# Altium schematic sheet ECE_1895_Pjt2_Sch_10_21_24.SchDoc
size A; SheetNumber: 1; SheetTotal: 3
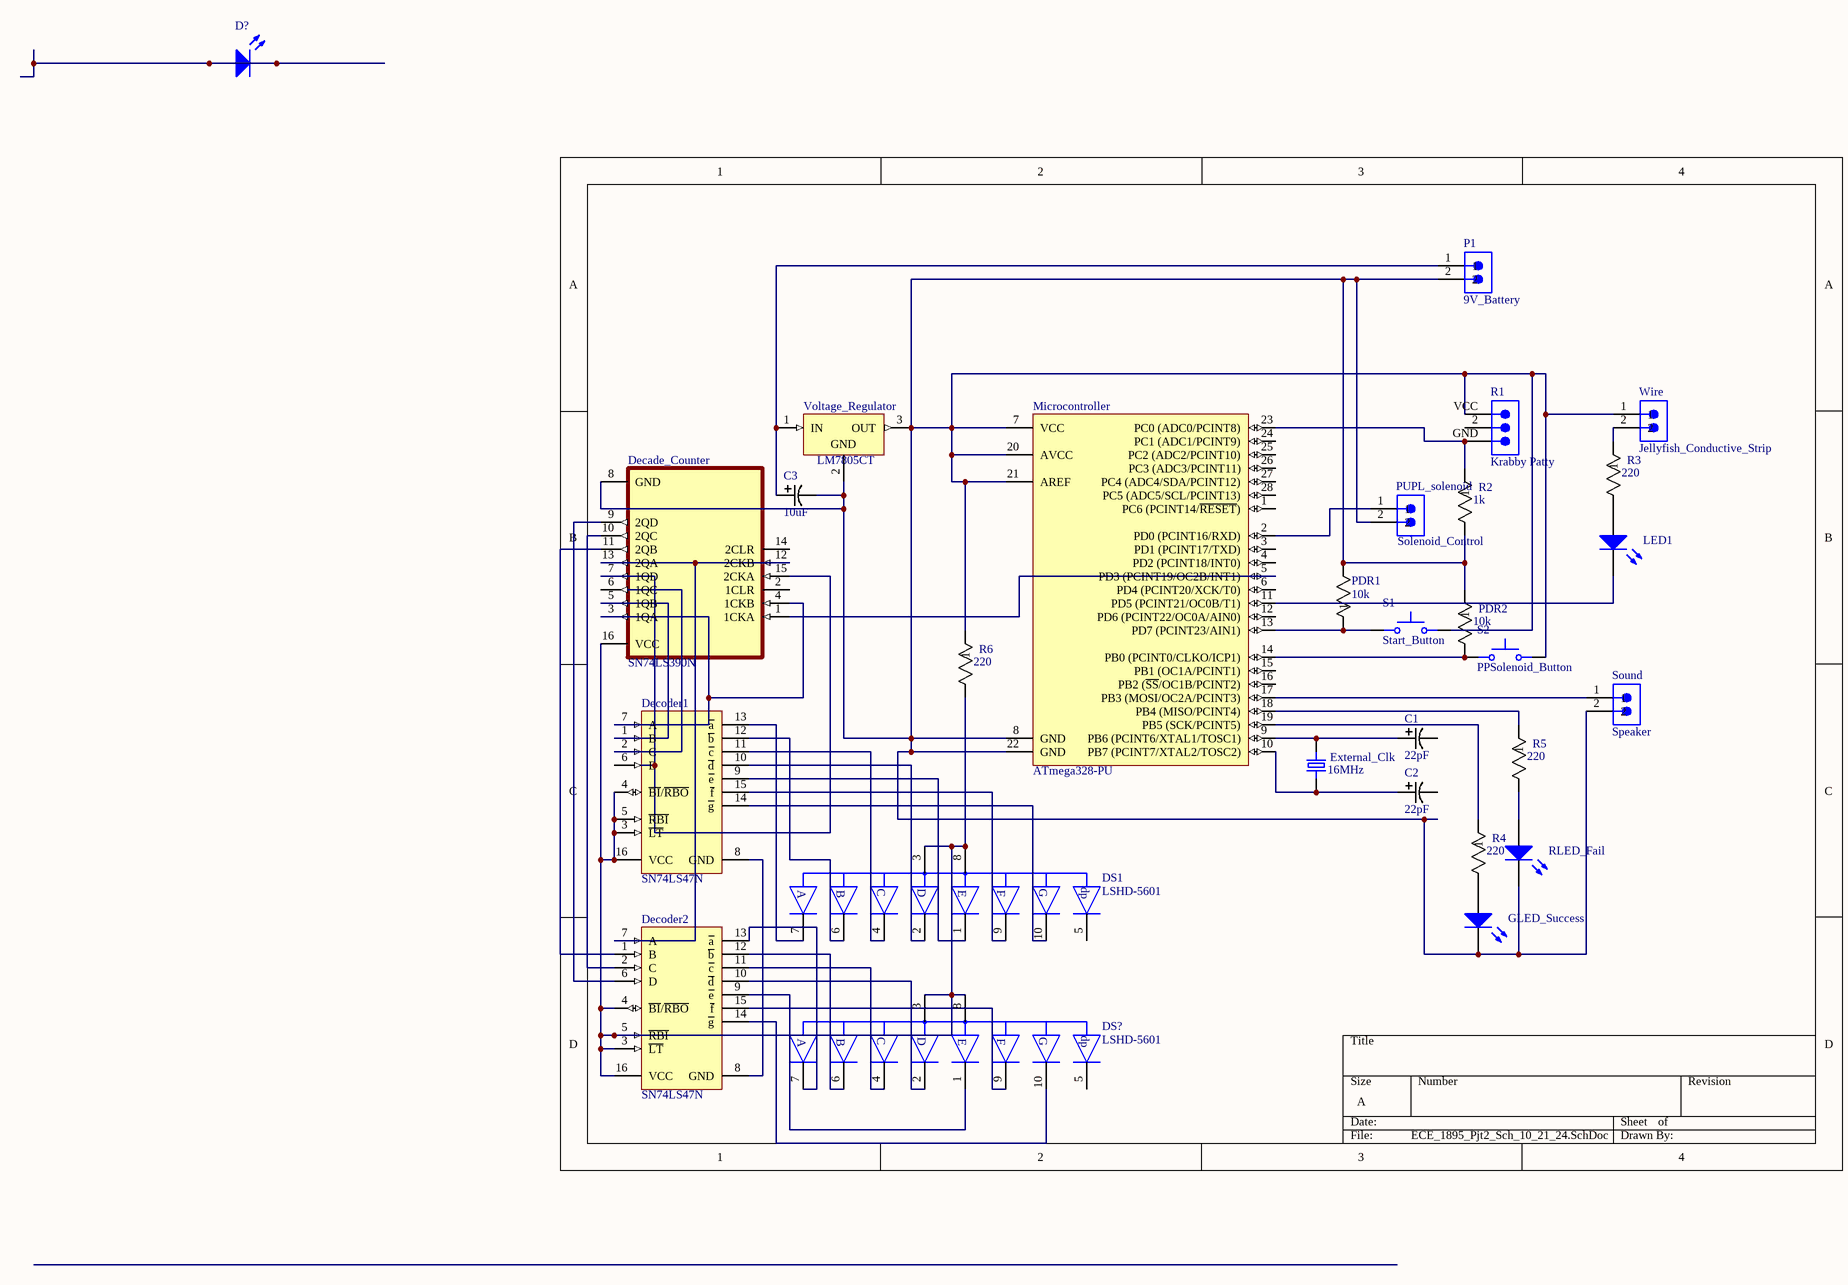
[diagram p0: ECE_1895_Pjt2_Sch_10_21_24.SchDoc]

## Parts
C1  22pF  [PCAP_8x112_PAN]
C2  22pF  [PCAP_8x112_PAN]
C3  10uF  [PCAP_8x112_PAN]
D?  Light-Emitting Diode  (value not drawn)
Decade_Counter  SN74LS390N  [DIP794W45P254L1969H508Q16]
Decoder1  SN74LS47N  [N0016A]
Decoder2  SN74LS47N  [N0016A]
DS1  LSHD-5601  [FP-LSHD-5601-MFG]
DS?  LSHD-5601  [FP-LSHD-5601-MFG]
External_Clk  16MHz  [XTAL_ECS-36-18-4X]
GLED_Success  Light-Emitting Diode  (value not drawn)
LED1  Light-Emitting Diode  (value not drawn)
Microcontroller  ATmega328-PU  [28P3]
P1  9V_Battery  [61300211121]
PDR1  10k  [STA_CF14_STP]
PDR2  10k  [STA_CF14_STP]
PUPL_solenoid  Solenoid_Control  [61300211121]
R1  Krabby Patty  [679303124022]
R2  1k  [STA_CF14_STP]
R3  220  [STA_CF14_STP]
R4  220  [STA_CF14_STP]
R5  220  [STA_CF14_STP]
R6  220  [STA_CF14_STP]
RLED_Fail  Light-Emitting Diode  (value not drawn)
S1  Start_Button  [SW_NCA1]
S2  PPSolenoid_Button  [SW_NCA1]
Sound  Speaker  [61300211121]
Voltage_Regulator  LM7805CT  [FAIR-TO-220-3]
Wire  Jellyfish_Conductive_Strip  [61300211121]

## Nets
NetC1_1: C1.1 External_Clk.2 Microcontroller.9(PB6_(PCINT6/XTAL1/TOSC1))
NetC2_1: C2.1 External_Clk.1 Microcontroller.10(PB7_(PCINT7/XTAL2/TOSC2))
NetC3_1: C3.1 P1.1 Voltage_Regulator.1(IN)
NetC3_2: C3.2 Decade_Counter.8(GND) GLED_Success.2(K) Microcontroller.7(VCC) Microcontroller.8(GND) Microcontroller.20(AVCC) Microcontroller.21(AREF) Microcontroller.22(GND) P1.2 PDR1.2 PDR2.1 PUPL_solenoid.2 R1.VCC R2.2 R6.1 RLED_Fail.2(K) S1.3 S2.3 Sound.2 Voltage_Regulator.2(GND) Voltage_Regulator.3(OUT) Wire.1
NetD?_1: D?.1(A) D?.2(K)
NetDecade_Counter_1: Decade_Counter.1(1CKA) Microcontroller.5(PD3_(PCINT19/OC2B/INT1))
NetDecade_Counter_3: Decade_Counter.3(1QA) Decade_Counter.4(1CKB) Decoder1.7(A)
NetDecade_Counter_5: Decade_Counter.5(1QB) Decoder1.1(B)
NetDecade_Counter_7: Decade_Counter.7(1QD) Decade_Counter.15(2CKA)
NetDecade_Counter_9: Decade_Counter.9(2QD) Decoder2.6(D)
NetDecade_Counter_10: Decade_Counter.10(2QC) Decoder2.2(C)
NetDecade_Counter_11: Decade_Counter.11(2QB) Decoder2.1(B)
NetDecade_Counter_12: Decade_Counter.12(2CKB) Decade_Counter.13(2QA) Decoder2.7(A)
NetDecade_Counter_16: Decade_Counter.16(VCC) Decoder1.3(~{LT}) Decoder1.4(~{BI}/~{RBO}) Decoder1.5(~{RBI}) Decoder1.16(VCC) Decoder2.3(~{LT}) Decoder2.4(~{BI}/~{RBO}) Decoder2.5(~{RBI}) Decoder2.16(VCC) DS1.3(COMMON_ANODE) DS1.8(COMMON_ANODE) DS?.3(COMMON_ANODE) DS?.8(COMMON_ANODE) R6.2
NetDecoder1_8: Decoder1.8(GND) Decoder2.8(GND)
NetDecoder1_9: Decoder1.9(~{e}) DS1.1(CATHODE_E)
NetDecoder1_10: Decoder1.10(~{d}) DS1.2(CATHODE_D)
NetDecoder1_11: Decoder1.11(~{c}) DS1.4(CATHODE_C)
NetDecoder1_12: Decoder1.12(~{b}) DS1.6(CATHODE_B)
NetDecoder1_13: Decoder1.13(~{a}) DS1.7(CATHODE_A)
NetDecoder1_14: Decoder1.14(~{g}) DS1.10(CATHODE_G)
NetDecoder1_15: Decoder1.15(~{f}) DS1.9(CATHODE_F)
NetDecoder2_9: Decoder2.9(~{e}) DS?.1(CATHODE_E)
NetDecoder2_10: Decoder2.10(~{d}) DS?.2(CATHODE_D)
NetDecoder2_11: Decoder2.11(~{c}) DS?.4(CATHODE_C)
NetDecoder2_12: Decoder2.12(~{b}) DS?.6(CATHODE_B)
NetDecoder2_13: Decoder2.13(~{a}) DS?.7(CATHODE_A)
NetDecoder2_14: Decoder2.14(~{g}) DS?.10(CATHODE_G)
NetDecoder2_15: Decoder2.15(~{f}) DS?.9(CATHODE_F)
NetGLED_Success_1: GLED_Success.1(A) R4.2
NetLED1_1: LED1.1(A) R3.2
NetLED1_2: LED1.2(K) Microcontroller.11(PD5_(PCINT21/OC0B/T1))
NetMicrocontroller_2: Microcontroller.2(PD0_(PCINT16/RXD)) PUPL_solenoid.1
NetMicrocontroller_13: Microcontroller.13(PD7_(PCINT23/AIN1)) PDR1.1 S1.1
NetMicrocontroller_14: Microcontroller.14(PB0_(PCINT0/CLKO/ICP1)) PDR2.2 S2.1
NetMicrocontroller_17: Microcontroller.17(PB3_(MOSI/OC2A/PCINT3)) Sound.1
NetMicrocontroller_18: Microcontroller.18(PB4_(MISO/PCINT4)) R5.1
NetMicrocontroller_19: Microcontroller.19(PB5_(SCK/PCINT5)) R4.1
NetMicrocontroller_23: Microcontroller.23(PC0_(ADC0/PCINT8)) R1.GND R2.1
NetR3_1: R3.1 Wire.2
NetR5_2: R5.2 RLED_Fail.1(A)

Not connected (* = marked no-connect by the designer): C1 2; C2 2; Decade_Counter 2(1CLR) 6(1QC) 14(2CLR); Decoder1 2(C) 6(D); DS1 5(CATHODE_DP); DS? 5(CATHODE_DP); Microcontroller 1(PC6_(PCINT14/~{RESET})) 3(PD1_(PCINT17/TXD)) 4(PD2_(PCINT18/INT0)) 6(PD4_(PCINT20/XCK/T0)) 12(PD6_(PCINT22/OC0A/AIN0)) 15(PB1_(OC1A/PCINT1)) 16(PB2_(~{SS}/OC1B/PCINT2)) 24(PC1_(ADC1/PCINT9)) 25(PC2_(ADC2/PCINT10)) 26(PC3_(ADC3/PCINT11)) 27(PC4_(ADC4/SDA/PCINT12)) 28(PC5_(ADC5/SCL/PCINT13)); R1 2

## Notes on the sheet
- (in symbol CMP-22013-000002-1) A; B; C; D; E; F; G; dp

## Library data of the parts
C1-C3 = ECA-2WHG010: No Description Available; Mfr_Name: Panasonic
D? GLED_Success LED1 RLED_Fail = LED: AF: 1; BV: 0; BV_MAX: 1e99; EG: 1.11; FC: 0.5; IBV: 0.001; IS: 1e-14; MJSW: 0.33; NTUN: 30; TNOM: 27; XTI: 3; SimulationGenericComponent: True; CJO: 0; CJP: 0; CTA: 0; CTP: 0; FCS: 0.5; FV_MAX: 1e99; IKF: 0; IKR: 0; ISR: 1e-14; JSW: 0; JTUN: 0; JTUNSW: 0; KEG: 1; KF: 0; LEVEL: 1; N: 1; NBV: 1; NR: 1; NS: 1; PHP: 1; RS: 0; TCV: 0; TLEV: 0; TLEVC: 0; TM1: 0; TM2: 0; TPB: 0; TPHP: 0; TRS: 0; TRS2: 0; TT: 0; TTT1: 0; TTT2: 0; VJ: 1; XTITUN: 3
Decoder1 Decoder2 = CMP-0388-00303-2: BCD-to-7-Segment Decoder / Driver, 4.75 to 5.25 V, 0 to 70 degC, 16-pin DIP (N16), Pb-Free (RoHS); Manufacturer: Texas Instruments; Rating: Catalog; SubFamily: Discrete Segment LED Driver; Vin(Max)(V): 5.25; Vin(Min)(V): 4.75; Eco-Plan: Pb-Free (RoHS); ComponentLink1URL: http://www.ti.com/; PackageReference: N0016A; PackageDescription: 16-Pin Plastic In-Line, Body 19.305 x 6.35 mm, Pitch 2.54 mm; ComponentLink1Description: Manufacturer URL; ComponentLink2URL: http://www.ti.com/general/docs/lit/getliterature.tsp?genericPartNumber=SN74LS47&fileType=pdf; Mounting Technology: Through Hole; ComponentLink3URL: http://www.ti.com/litv/pdf/mpdi002c; Code_JEDEC: MS-001; DatasheetVersion: SDLS111; PartNumber: SN74LS47N; ComponentLink2Description: Datasheet; ComponentLink3Description: Package Specification; PackageVersion: 4040049/E
DS1 DS? = CMP-22013-000002-1: LED 7-SEG .56" GREEN 565NM CA; Manufacturer: Lite-On; Wavelength: 569nm; Luminous Intensity: 2.4mcd; Forward Current: 20mA; Forward Voltage: 2.1V; Element Config: Common Anode; Reverse Voltage: 5V; Device Class L1: Optoelectronics; ComponentLink2URL: https://media.digikey.com/pdf/Data%20Sheets/Lite-On%20PDFs/LSHD-5601.pdf; Temperature Range High: +105°C; ComponentLink2Description: Datasheet; Automotive: No; Temperature: -35°C to +105°C; Mouser Description: LED Displays & Accessories Green, Low Current 0.56, CARHD; Package: LSHD-5601; Device Class L3: LED Displays; Height: 8.25mm; Digikey Description: LED 7-SEG .56" GREEN 565NM CA; Category: Disp; Display Type: LED; Octopart: https://octopart.com/lshd-5601-lite-on-548440; Lead Free: Yes; Temperature Range Low: -35°C; RoHS: TRUE; Test Current: 20mA; Manufacturer Part Number: LSHD-5601; Device Class L2: Displays
External_Clk = ECS-36-18-4X: CRYSTAL T/H; Package: None; Price: None; Value: *; MP: ECS-36-18-4X; Availability: Unavailable
Microcontroller = CMP-0095-00015-2: 8-bit AVR Microcontroller, 32KB Flash, 1KB EEPROM, 2KB SRAM, 28-pin PDIP, Industrial Grade (-40°C to 85°C); ComponentLink3Description: ATmega48A/48PA/88A/88PA/168A/168PA/328/328P Summary; RevisionNote: DatasheetVersion updated. URLs added.; DatasheetVersion: revD, May-2011; ComponentLink1URL: http://www.atmel.com/; PackageVersion: revB, Sep-2001; PackageDescription: 28-lead (0.300"/7.62mm Wide) Plastic Dual Inline Package (PDIP); PackageReference: 28P3; ComponentLink1Description: Manufacturer URL; ComponentLink2Description: ATmega48A/48PA/88A/88PA/168A/168PA/328/328P Datasheet; ComponentLink3URL: http://www.atmel.com/dyn/resources/prod_documents/8271S.pdf; ComponentLink2URL: http://www.atmel.com/dyn/resources/prod_documents/8271.pdf
P1 PUPL_solenoid Sound Wire = CMP-1712-00002-6: NexarPartId: 20081794; Number of Contacts: 2; Pitch: 2.54mm; Connector Type: Male Pin; Voltage Rating: 250V; Current Rating: 3A; Gender: Male; Contact Resistance: 20mΩ; Height: 8.94mm; Lead Free: Lead Free; Number of Pins: 2; Termination: Through Hole; RoHS: Compliant; Lead Pitch: 2.54mm; REACH SVHC: No SVHC; Housing Material: PBT; Contact Mating Length: 5.9944mm; Min Operating Temperature: -40°C; Orientation: Vertical; Contact Material: Copper; Contact Gender: Male; Max Operating Temperature: 125°C; Number of Rows: 1; Number of Positions: 2; Packaging: Bulk; Contact Plating: Gold; Mount: Through Hole; Color: Black; Operating Supply Voltage: 250V
PDR1 PDR2 R2-R6 = CF14JT10K0: No Description Available; Mfr_Name: Stackpole International
R1 = CMP-1502-00722-2: NexarPartId: 18818282; Insulation: Insulated; Operating Supply Voltage: 50V; Number of Contacts: 3; Current Rating: 1A; Insulation Resistance: 100MΩ; Gender: Male; Contact Resistance: 20mΩ; Connector Type: Male Pin; Pitch: 1.5mm; Number of Pins: 3; Flammability Rating: UL94 V-0; Lead Pitch: 1.5mm; Max Operating Temperature: 85°C; Contact Plating: Tin; Contact Gender: Male; Height: 5mm; Contact Material: Copper; Mount: Surface Mount; Termination: SMD/SMT; Number of Positions: 3; Color: Beige, White; Length: 7.5mm; Voltage Rating: 50V; Packaging: Tape and Reel; RoHS: Compliant; Housing Material: Nylon; Width: 7.5mm; Number of Rows: 1; Orientation: Vertical; REACH SVHC: No SVHC; Min Operating Temperature: -25°C
S1 S2 = NCA1: Package: None; Price: None; Value: *; MP: NCA1; Availability: Unavailable
Voltage_Regulator = CMP-2000-04938-1: Positive Voltage Regulator, 5 V, 1 A, -40 to 125 degC, 3-Pin TO-220, RoHS, Tube; Manufacturer: FairchildSemiconductor; Maximum Input Voltage: 35V; Maximum Quiescent Current: 8mA; Load Regulation: 100mV; Maximum Output Current: 2.2(Typ)A; Output Type: Fixed; Typical Dropout Voltage @ Current: 2@1AV; Rad Hard: No; Output Voltage: 5V; Accuracy: ±4%; Number of Outputs: 1; Category: LinearRegulator; Package Description: 3-Pin Through Hole Device, Body 10 x 4.5 mm, Pitch 2.54 mm; Packaging: Rail/Tube; Mounting: ThroughHole; Polarity: Positive; Manufacturer URL: https://www.fairchildsemi.com/; Line Regulation: 100mV; Datasheet Version: Aug-12; Datasheet URL: https://datasheet.ciiva.com/26904/lm7805ct-26904988.pdf; Package Reference: TO-220; Package URL: https://www.fairchildsemi.com/package-drawings/TO/TO220B03.pdf; Package: 3TO-220AB; Operating Temperature: -40to125degC; Type: Linear
Decade_Counter = SN74LS390N: Package: None; Price: None; Value: *; MP: SN74LS390N; Availability: Unavailable